# Altium schematic sheet TH4.SchDoc
size Letter; SheetNumber: 5; SheetTotal: 6
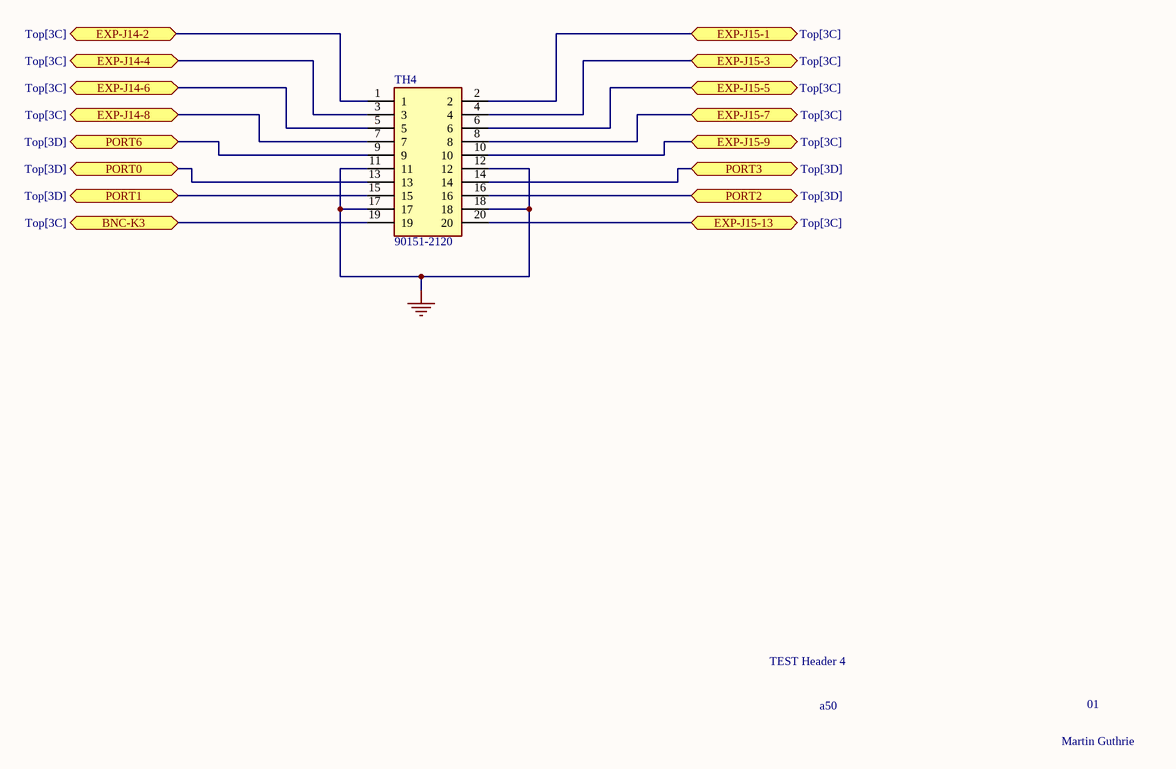
[diagram p0: TH4.SchDoc]

## Parts
TH4  90151-2120  [90151-2120]

## Ports
BNC-K3 (bidir, see Top[3C]), EXP-J14-2 (bidir, see Top[3C]), EXP-J14-4 (bidir, see Top[3C]), EXP-J14-6 (bidir, see Top[3C]), EXP-J14-8 (bidir, see Top[3C]), EXP-J15-1 (bidir, see Top[3C]), EXP-J15-3 (bidir, see Top[3C]), EXP-J15-5 (bidir, see Top[3C]), EXP-J15-7 (bidir, see Top[3C]), EXP-J15-9 (bidir, see Top[3C]), EXP-J15-13 (bidir, see Top[3C]), PORT0 (bidir, see Top[3D]), PORT1 (bidir, see Top[3D]), PORT2 (bidir, see Top[3D]), PORT3 (bidir, see Top[3D]), PORT6 (bidir, see Top[3D])

## Nets
GND: TH4.11 TH4.12 TH4.17 TH4.18
BNC-K3: TH4.19 ; port BNC-K3
EXP-J14-2: TH4.1 ; port EXP-J14-2
EXP-J14-4: TH4.3 ; port EXP-J14-4
EXP-J14-6: TH4.5 ; port EXP-J14-6
EXP-J14-8: TH4.7 ; port EXP-J14-8
EXP-J15-1: TH4.2 ; port EXP-J15-1
EXP-J15-3: TH4.4 ; port EXP-J15-3
EXP-J15-5: TH4.6 ; port EXP-J15-5
EXP-J15-7: TH4.8 ; port EXP-J15-7
EXP-J15-9: TH4.10 ; port EXP-J15-9
EXP-J15-13: TH4.20 ; port EXP-J15-13
PORT0: TH4.13 ; port PORT0
PORT1: TH4.15 ; port PORT1
PORT2: TH4.16 ; port PORT2
PORT3: TH4.14 ; port PORT3
PORT6: TH4.9 ; port PORT6

## Notes on the sheet
- TEST Header 4
- a50
- 01
- Martin Guthrie

## Library data of the parts
TH4 = 90151-2120: Connector; Manufacturer_Name: Molex; Datasheet Link: https://www.molex.com/pdm_docs/sd/901512120_sd.pdf; Height: 8.7mm; Manufacturer_Part_Number: 90151-2120; Mouser Part Number: 538-90151-2120; Mouser Price/Stock: https://www.mouser.co.uk/ProductDetail/Molex/90151-2120?qs=XmV31zLAuMHqFInYdcmaXg%3D%3D